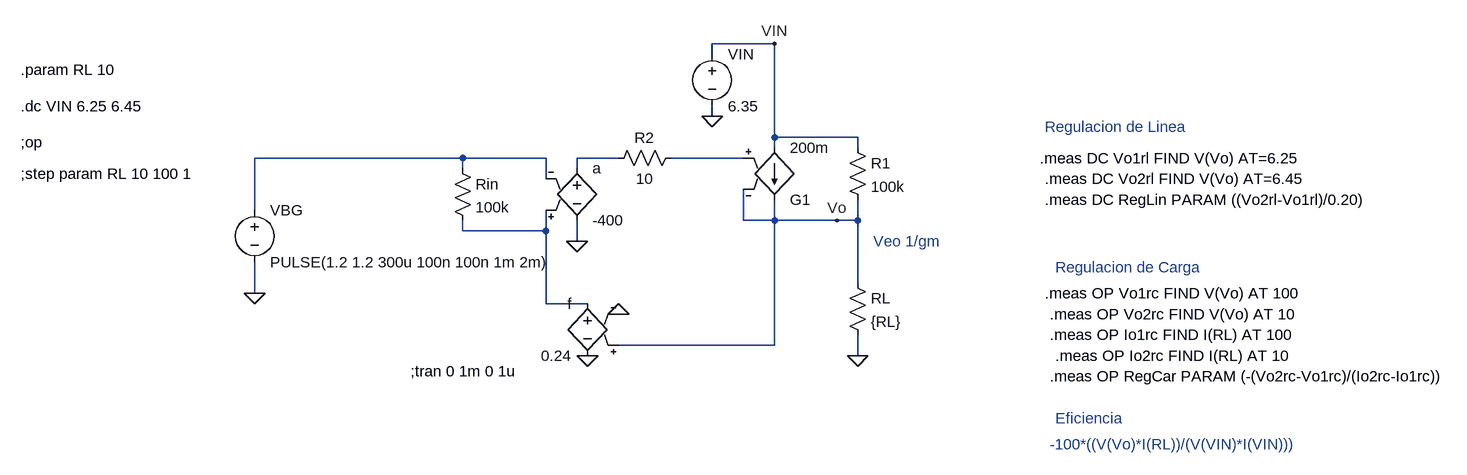
[diagram p0: schematic Diagrama_en_bloques_regulador.asc]
Diagrama_en_bloques_regulador.asc, the LTspice schematic file:
Version 4
SHEET 1 1196 680
WIRE 112 -464 16 -464
WIRE 16 -448 16 -464
WIRE 16 -352 16 -368
WIRE 112 -320 112 -464
WIRE 240 -320 112 -320
WIRE 112 -304 112 -320
WIRE 240 -304 240 -320
WIRE -368 -288 -688 -288
WIRE -240 -288 -368 -288
WIRE -128 -288 -192 -288
WIRE 64 -288 -48 -288
WIRE -368 -272 -368 -288
WIRE -192 -272 -192 -288
WIRE -240 -256 -240 -288
WIRE -688 -208 -688 -288
WIRE 64 -192 64 -240
WIRE 112 -192 112 -224
WIRE 112 -192 64 -192
WIRE 208 -192 112 -192
WIRE 240 -192 240 -224
WIRE 240 -192 208 -192
WIRE -368 -176 -368 -192
WIRE -240 -176 -240 -208
WIRE -240 -176 -368 -176
WIRE -192 -160 -192 -192
WIRE 240 -96 240 -192
WIRE -688 -80 -688 -128
WIRE -240 -64 -240 -176
WIRE -176 -64 -240 -64
WIRE 112 0 112 -192
WIRE 112 0 -128 0
WIRE 240 16 240 -16
FLAG -192 -160 0
FLAG 240 16 0
FLAG -128 -48 0
FLAG -176 16 0
FLAG -688 -80 0
FLAG 208 -192 Vo
FLAG 16 -352 0
FLAG 112 -464 VIN
SYMBOL e2 -192 -288 R0
SYMATTR InstName a
SYMATTR Value -400
SYMBOL voltage -688 -224 R0
WINDOW 123 0 0 Left 0
WINDOW 39 0 0 Left 0
SYMATTR InstName VBG
SYMATTR Value PULSE(1.2 1.2 300u 100n 100n 1m 2m)
SYMBOL res -384 -288 R0
SYMATTR InstName Rin
SYMATTR Value 100k
SYMBOL res -32 -304 R90
WINDOW 0 0 56 VBottom 2
WINDOW 3 32 56 VTop 2
SYMATTR InstName R2
SYMATTR Value 10
SYMBOL res 224 -112 R0
SYMATTR InstName RL
SYMATTR Value {RL}
SYMBOL e2 -176 -80 M0
SYMATTR InstName f
SYMATTR Value 0.24
SYMBOL g2 112 -208 M180
SYMATTR InstName G1
SYMATTR Value 200m
SYMBOL voltage 16 -464 R0
WINDOW 123 0 0 Left 0
WINDOW 39 0 0 Left 0
SYMATTR InstName VIN
SYMATTR Value 6.35
SYMBOL res 224 -320 R0
SYMATTR InstName R1
SYMATTR Value 100k
TEXT -448 40 Left 2 !;tran 0 1m 0 1u
TEXT 264 -160 Left 2 ;Veo 1/gm
TEXT 520 -288 Left 2 !.meas DC Vo1rl FIND V(Vo) AT=6.25
TEXT 528 -256 Left 2 !.meas DC Vo2rl FIND V(Vo) AT=6.45
TEXT 528 -224 Left 2 !.meas DC RegLin PARAM ((Vo2rl-Vo1rl)/0.20)
TEXT -1048 -368 Left 2 !.dc VIN 6.25 6.45
TEXT -1048 -312 Left 2 !;op
TEXT -1048 -264 Left 2 !;step param RL 10 100 1
TEXT 528 -80 Left 2 !.meas OP Vo1rc FIND V(Vo) AT 100
TEXT 536 -48 Left 2 !.meas OP Vo2rc FIND V(Vo) AT 10
TEXT 536 -16 Left 2 !.meas OP Io1rc FIND I(RL) AT 100
TEXT 544 16 Left 2 !.meas OP Io2rc FIND I(RL) AT 10
TEXT 536 48 Left 2 !.meas OP RegCar PARAM (-(Vo2rc-Vo1rc)/(Io2rc-Io1rc))
TEXT 528 -336 Left 2 ;Regulacion de Linea
TEXT 544 -120 Left 2 ;Regulacion de Carga
TEXT 536 152 Left 2 ;-100*((V(Vo)*I(RL))/(V(VIN)*I(VIN)))
TEXT 544 112 Left 2 ;Eficiencia
TEXT -1048 -424 Left 2 !.param RL 10

The netlist it stands for:
* Diagrama_en_bloques_regulador.asc
E§a N002 0 N004 N001 -400
VBG N001 0 PULSE(1.2 1.2 300u 100n 100n 1m 2m)
Rin N001 N004 100k
R2 N003 N002 10
RL Vo 0 {RL}
E§f N004 0 Vo 0 0.24
G1 VIN Vo N003 Vo 200m
VIN VIN 0 6.35
R1 VIN Vo 100k
;tran 0 1m 0 1u
* Veo 1/gm
.meas DC Vo1rl FIND V(Vo) AT=6.25
.meas DC Vo2rl FIND V(Vo) AT=6.45
.meas DC RegLin PARAM ((Vo2rl-Vo1rl)/0.20)
.dc VIN 6.25 6.45
;op
;step param RL 10 100 1
.meas OP Vo1rc FIND V(Vo) AT 100
.meas OP Vo2rc FIND V(Vo) AT 10
.meas OP Io1rc FIND I(RL) AT 100
.meas OP Io2rc FIND I(RL) AT 10
.meas OP RegCar PARAM (-(Vo2rc-Vo1rc)/(Io2rc-Io1rc))
* Regulacion de Linea
* Regulacion de Carga
* -100*((V(Vo)*I(RL))/(V(VIN)*I(VIN)))
* Eficiencia
.param RL 10
.backanno
.end